# EAGLE schematic DC24-Darknet_Badge (EAGLE 7.5.0)
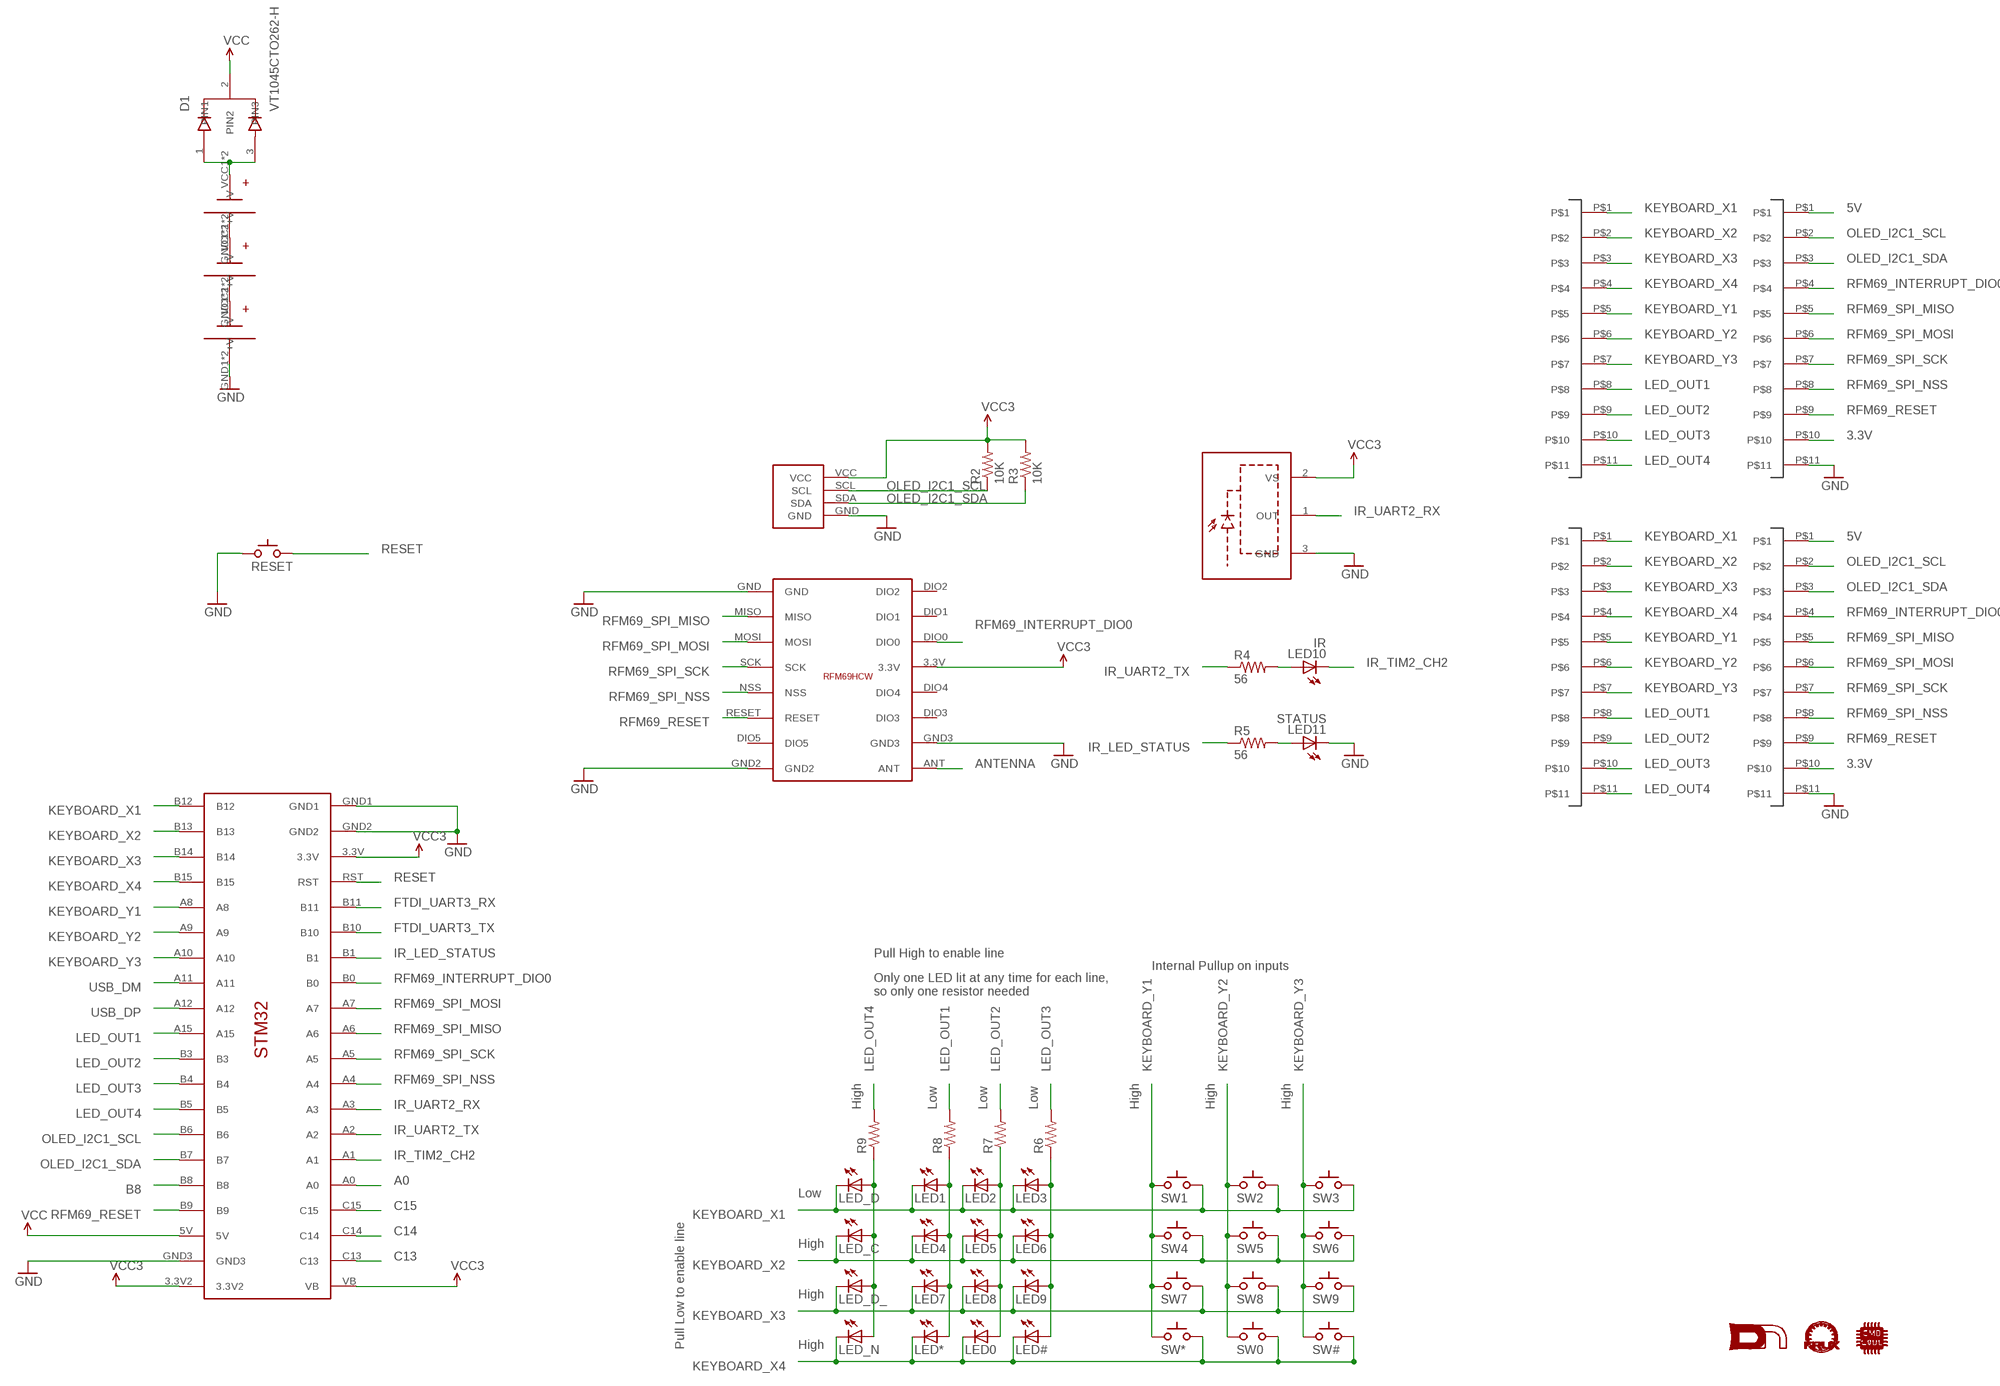
[diagram p0: schematic, sheet 1]

## Parts
D1  VT1045CTO262-H  [TO262-H]
LED0  LEDREVERSEMOUNT  [GULLWING_LED]
LED1  LEDREVERSEMOUNT  [GULLWING_LED]
LED2  LEDREVERSEMOUNT  [GULLWING_LED]
LED3  LEDREVERSEMOUNT  [GULLWING_LED]
LED4  LEDREVERSEMOUNT  [GULLWING_LED]
LED5  LEDREVERSEMOUNT  [GULLWING_LED]
LED6  LEDREVERSEMOUNT  [GULLWING_LED]
LED7  LEDREVERSEMOUNT  [GULLWING_LED]
LED8  LEDREVERSEMOUNT  [GULLWING_LED]
LED9  LEDREVERSEMOUNT  [GULLWING_LED]
LED10  IR  LEDLED5MM_EDGE  [LED5MM-EDGE]
LED11  STATUS  LEDLED5MM_EDGE  [LED5MM-EDGE]
LED#  LEDREVERSEMOUNT  [GULLWING_LED]
LED*  LEDREVERSEMOUNT  [GULLWING_LED]
LED_C  LEDREVERSEMOUNT  [GULLWING_LED]
LED_D  LEDREVERSEMOUNT  [GULLWING_LED]
LED_D_  LEDREVERSEMOUNT  [GULLWING_LED]
LED_N  LEDREVERSEMOUNT  [GULLWING_LED]
Q1  SOP22  [IR-MODULE]
R2  10K  RESISTORAXIAL-0.3  [AXIAL-0.3]
R3  10K  RESISTORAXIAL-0.3  [AXIAL-0.3]
R4  56  RESISTORAXIAL-0.3  [AXIAL-0.3]
R5  56  RESISTORAXIAL-0.3  [AXIAL-0.3]
R6  RESISTOR1206  [1206]
R7  RESISTOR1206  [1206]
R8  RESISTOR1206  [1206]
R9  RESISTOR1206  [1206]
RESET  SWITCH_TACTILETACTILE-2PIN-NARROW  [TACTILE-2PIN-NARROW]
SW0  SWITCH_TACTILETACTILE-2PIN-NARROW  [TACTILE-2PIN-NARROW]
SW1  SWITCH_TACTILETACTILE-2PIN-NARROW  [TACTILE-2PIN-NARROW]
SW2  SWITCH_TACTILETACTILE-2PIN-NARROW  [TACTILE-2PIN-NARROW]
SW3  SWITCH_TACTILETACTILE-2PIN-NARROW  [TACTILE-2PIN-NARROW]
SW4  SWITCH_TACTILETACTILE-2PIN-NARROW  [TACTILE-2PIN-NARROW]
SW5  SWITCH_TACTILETACTILE-2PIN-NARROW  [TACTILE-2PIN-NARROW]
SW6  SWITCH_TACTILETACTILE-2PIN-NARROW  [TACTILE-2PIN-NARROW]
SW7  SWITCH_TACTILETACTILE-2PIN-NARROW  [TACTILE-2PIN-NARROW]
SW8  SWITCH_TACTILETACTILE-2PIN-NARROW  [TACTILE-2PIN-NARROW]
SW9  SWITCH_TACTILETACTILE-2PIN-NARROW  [TACTILE-2PIN-NARROW]
SW#  SWITCH_TACTILETACTILE-2PIN-NARROW  [TACTILE-2PIN-NARROW]
SW*  SWITCH_TACTILETACTILE-2PIN-NARROW  [TACTILE-2PIN-NARROW]
U$1  I2C_0.96_OLEDOLED  [I2C_0.96_OLED]
U$2  RFM69HCWRFN69HCWSMD  [16PIN-PCB-SMD]
U$3  AAA_BATTERYAAA_BATTERY_CLIP  [AAA_BATTERY_CLIP]
U$4  AAA_BATTERYAAA_BATTERY_CLIP  [AAA_BATTERY_CLIP]
U$5  AAA_BATTERYAAA_BATTERY_CLIP  [AAA_BATTERY_CLIP]
U$6  HEADER_11PIN  [1X11]
U$13  HEADER_11PIN  [1X11]
U$14  HEADER_11PIN  [1X11]
U$15  STM32_DEV_BOARDSTM32_DEV_BOARD  [STM32_DEV_BOARD]
U$17  HEADER_11PIN  [1X11]
U$21  KRUX_LOGO  [KRUX_LOGO]
U$22  DN_LOGO  [DN_LOGO]
U$23  CMD_C0DE_LOGO  [CMD_C0DE_LOGO]

## Nets
3.3V: Q1.2(VS) R2.P$2 R3.P$2 U$1.VCC U$2.3.3V U$13.P$10 U$15.3.3V U$15.3.3V2 U$15.VB U$17.P$10 ; supply symbol labelled VCC3
5V: D1.2(PIN2) U$13.P$1 U$15.5V U$17.P$1 ; supply symbol labelled VCC
A0: U$15.A0
ANTENNA: U$2.ANT
B8: U$15.B8
C13: U$15.C13
C14: U$15.C14
C15: U$15.C15
FTDI_UART3_RX: U$15.B11
FTDI_UART3_TX: U$15.B10
GND: LED11.K(C) Q1.3(GND) RESET.P$2(C) U$1.GND U$2.GND U$2.GND2 U$2.GND3 U$5.GND1(-V) U$5.GND2(-V) U$13.P$11 U$15.GND1 U$15.GND2 U$15.GND3 U$17.P$11
IR_LED_STATUS: R5.P$1 U$15.B1
IR_TIM2_CH2: LED10.K(C) U$15.A1
IR_UART2_RX: Q1.1(OUT) U$15.A3
IR_UART2_TX: R4.P$1 U$15.A2
KEYBOARD_X1: LED1.C LED2.C LED3.C LED_D.C SW1.P$1(A) SW2.P$1(A) SW3.P$1(A) U$6.P$1 U$14.P$1 U$15.B12
KEYBOARD_X2: LED4.C LED5.C LED6.C LED_C.C SW4.P$1(A) SW5.P$1(A) SW6.P$1(A) U$6.P$2 U$14.P$2 U$15.B13
KEYBOARD_X3: LED7.C LED8.C LED9.C LED_D_.C SW7.P$1(A) SW8.P$1(A) SW9.P$1(A) U$6.P$3 U$14.P$3 U$15.B14
KEYBOARD_X4: LED0.C LED#.C LED*.C LED_N.C SW0.P$1(A) SW#.P$1(A) SW*.P$1(A) U$6.P$4 U$14.P$4 U$15.B15
KEYBOARD_Y1: SW1.P$2(C) SW4.P$2(C) SW7.P$2(C) SW*.P$2(C) U$6.P$5 U$14.P$5 U$15.A8
KEYBOARD_Y2: SW0.P$2(C) SW2.P$2(C) SW5.P$2(C) SW8.P$2(C) U$6.P$6 U$14.P$6 U$15.A9
KEYBOARD_Y3: SW3.P$2(C) SW6.P$2(C) SW9.P$2(C) SW#.P$2(C) U$6.P$7 U$14.P$7 U$15.A10
LED_OUT1: R8.2 U$6.P$8 U$14.P$8 U$15.A15
LED_OUT2: R7.2 U$6.P$9 U$14.P$9 U$15.B3
LED_OUT3: R6.2 U$6.P$10 U$14.P$10 U$15.B4
LED_OUT4: R9.2 U$6.P$11 U$14.P$11 U$15.B5
N$1: LED10.A R4.P$2
N$2: LED11.A R5.P$2
N$3: D1.1(PIN1) D1.3(PIN3) U$3.VCC1(+V) U$3.VCC2(+V)
N$8: LED3.A LED6.A LED9.A LED#.A R6.1
N$9: LED0.A LED2.A LED5.A LED8.A R7.1
N$10: LED1.A LED4.A LED7.A LED*.A R8.1
N$11: LED_C.A LED_D.A LED_D_.A LED_N.A R9.1
N$13: U$3.GND1(-V) U$3.GND2(-V) U$4.VCC1(+V) U$4.VCC2(+V)
N$14: U$4.GND1(-V) U$4.GND2(-V) U$5.VCC1(+V) U$5.VCC2(+V)
OLED_I2C1_SCL: R2.P$1 U$1.SCL U$13.P$2 U$15.B6 U$17.P$2
OLED_I2C1_SDA: R3.P$1 U$1.SDA U$13.P$3 U$15.B7 U$17.P$3
RESET: RESET.P$1(A) U$15.RST
RFM69_INTERRUPT_DIO0: U$2.DIO0 U$13.P$4 U$15.B0 U$17.P$4
RFM69_RESET: U$2.RESET U$13.P$9 U$15.B9 U$17.P$9
RFM69_SPI_MISO: U$2.MISO U$13.P$5 U$15.A6 U$17.P$5
RFM69_SPI_MOSI: U$2.MOSI U$13.P$6 U$15.A7 U$17.P$6
RFM69_SPI_NSS: U$2.NSS U$13.P$8 U$15.A4 U$17.P$8
RFM69_SPI_SCK: U$2.SCK U$13.P$7 U$15.A5 U$17.P$7
USB_DM: U$15.A11
USB_DP: U$15.A12
Unconnected: U$2.DIO1 U$2.DIO2 U$2.DIO3 U$2.DIO4 U$2.DIO5

## Notes on the sheet
- Pull High to enable line
- Internal Pullup on inputs
- Only one LED lit at any time for each line,
  so only one resistor needed
- High | Low | Low | Low | High | High | High
- Low
- High
- High
- Pull Low to enable line | High

## Library data of the parts
D1 = SYNShop:VT1045C
LED0 LED1-LED11 LED# LED* LED_C LED_D LED_D_ LED_N = SYNShop:LED: LEDs Standard schematic elements and footprints for 5mm, 3mm, 1206, and 0603 sized LEDs. 5mm - Spark Fun Electronics SKU : COM-00529 (and others)
Q1 = SYNShop:SOP22
R2-R9 = SYNShop:RESISTOR: Resistor Basic schematic elements and footprints for 0603, 1206, and PTH resistors.
RESET SW0 SW1-SW9 SW# SW* = SYNShop:SWITCH_TACTILE
U$1 = SYNShop:I2C_0.96_OLED
U$2 = SYNShop:RFM69HCW
U$3-U$5 = SYNShop:AAA_BATTERY
U$6 U$13 U$14 U$17 = SYNShop:HEADER_11PIN
U$15 = SYNShop:STM32_DEV_BOARD
U$21 = SYNShop:KRUX_LOGO
U$22 = SYNShop:DN_LOGO
U$23 = SYNShop:CMD_C0DE_LOGO